# Altium project rs232_24V_step_Vano.PrjPcb
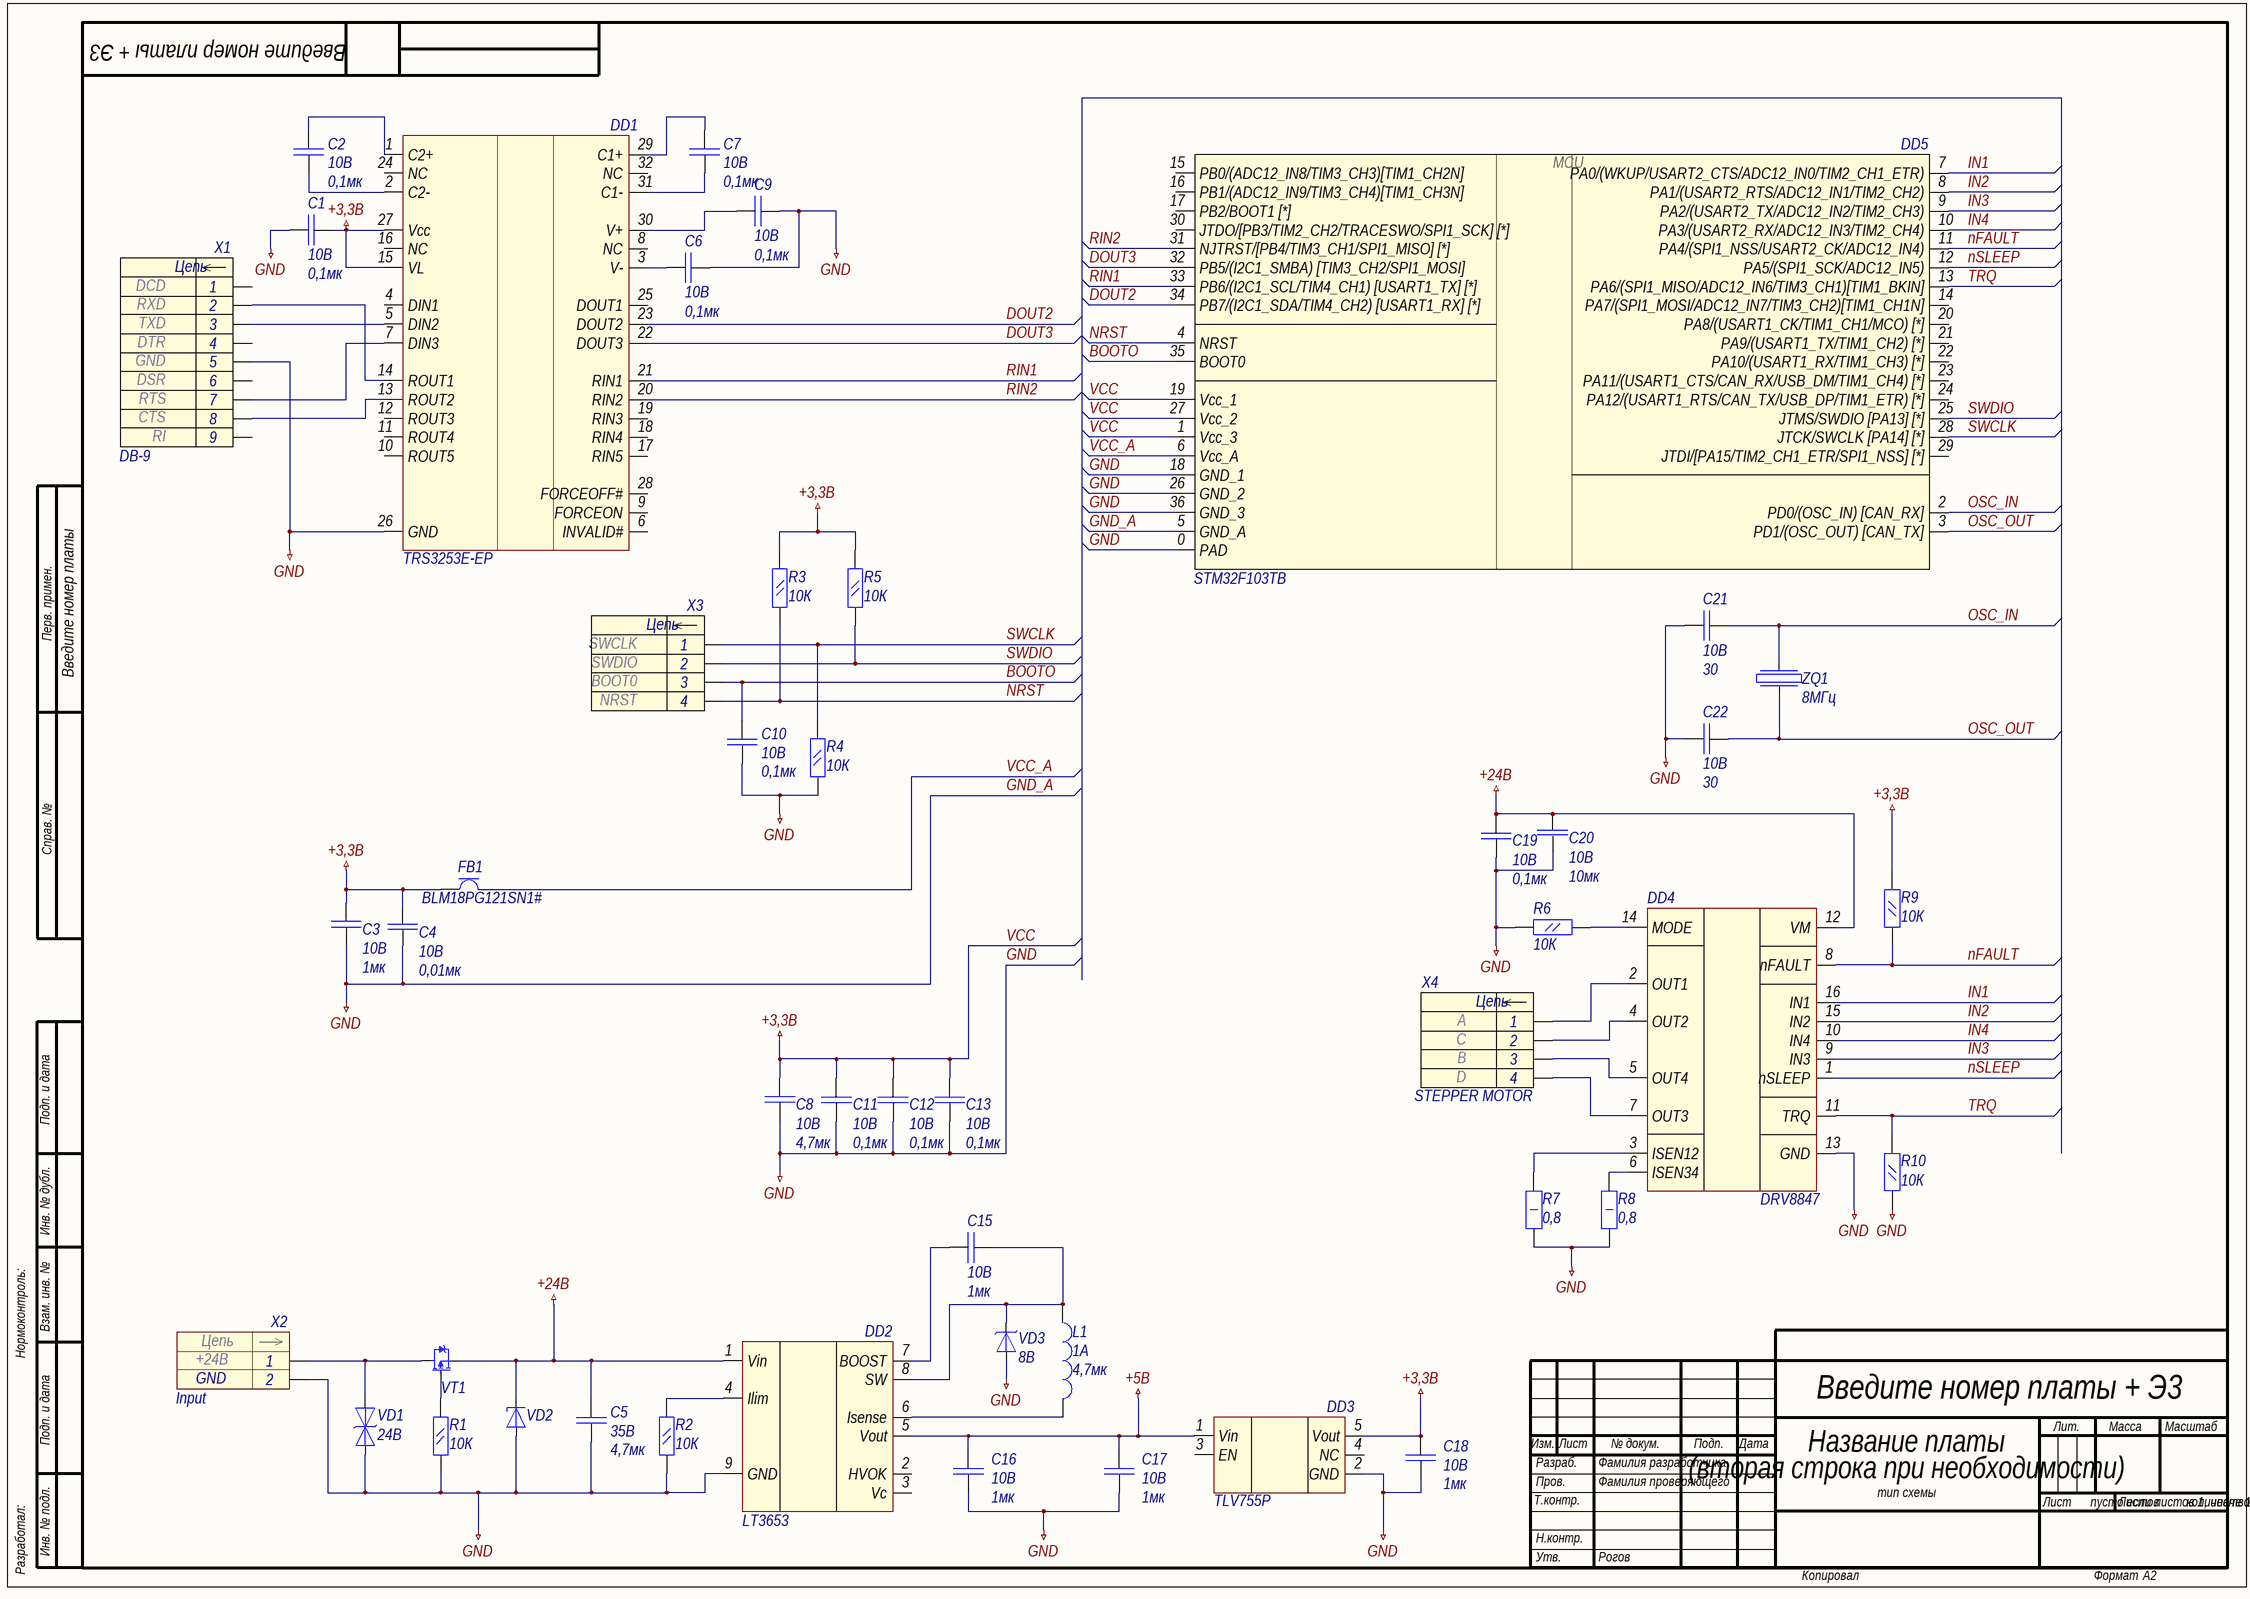
[diagram p0: VanoDolbano.schdoc]
1 sheet, 47 parts. Net scope: global (net labels, ports and power ports of the same name join across sheets).
Board file: rodin_24V_step.PcbDoc

## Sheet VanoDolbano.schdoc: Название платы
size 594 x 420 mm; ApprovedBy: Рогов; CheckedBy: Фамилия проверяющего; DrawnBy: Фамилия разработчика; DocumentNumber: Введите номер платы + Э3; SheetNumber: пусто если листов 1, иначе 1; SheetTotal: количество листов; Format: A2; DocumentType: тип схемы; Title1str: (вторая строка при необходимости); ImagePath: Введите номер платы

### Parts
C1  Voltage: 10В  Capacitance: 0,1мк  [CH0402C]  (hidden comment: Capacitor)
C2  Voltage: 10В  Capacitance: 0,1мк  [CH0402C]  (hidden comment: Capacitor)
C3  Voltage: 10В  Capacitance: 1мк  [CH0201C]  (hidden comment: Capacitor)
C4  Voltage: 10В  Capacitance: 0,01мк  [CH0402C]  (hidden comment: Capacitor)
C5  Voltage: 35В  Capacitance: 4,7мк  [CH0603C]  (hidden comment: Capacitor)
C6  Voltage: 10В  Capacitance: 0,1мк  [CH0402C]  (hidden comment: Capacitor)
C7  Voltage: 10В  Capacitance: 0,1мк  [CH0402C]  (hidden comment: Capacitor)
C8  Voltage: 10В  Capacitance: 4,7мк  [CH0402C]  (hidden comment: Capacitor)
C9  Voltage: 10В  Capacitance: 0,1мк  [CH0402C]  (hidden comment: Capacitor)
C10  Voltage: 10В  Capacitance: 0,1мк  [CH0402C]  (hidden comment: Capacitor)
C11  Voltage: 10В  Capacitance: 0,1мк  [CH0402C]  (hidden comment: Capacitor)
C12  Voltage: 10В  Capacitance: 0,1мк  [CH0402C]  (hidden comment: Capacitor)
C13  Voltage: 10В  Capacitance: 0,1мк  [CH0402C]  (hidden comment: Capacitor)
C15  Voltage: 10В  Capacitance: 1мк  [CH0201C]  (hidden comment: Capacitor)
C16  Voltage: 10В  Capacitance: 1мк  [CH0201C]  (hidden comment: Capacitor)
C17  Voltage: 10В  Capacitance: 1мк  [CH0201C]  (hidden comment: Capacitor)
C18  Voltage: 10В  Capacitance: 1мк  [CH0201C]  (hidden comment: Capacitor)
C19  Voltage: 10В  Capacitance: 0,1мк  [CH0402C]  (hidden comment: Capacitor)
C20  Voltage: 10В  Capacitance: 10мк  [CH0402C]  (hidden comment: Capacitor)
C21  Voltage: 10В  Capacitance: 30  [CH0201C]  (hidden comment: Capacitor)
C22  Voltage: 10В  Capacitance: 30  [CH0201C]  (hidden comment: Capacitor)
DD1  TRS3253E-EP  [TRS3253E-EP]
DD2  LT3653  [LT3653]
DD3  TLV755P  [SOT23-5]
DD4  DRV8847  [DRV8847]
DD5  STM32F103TB  [STM32_f103_36Pins]
FB1  Model: BLM18PG121SN1#  [CH0603L]  (hidden comment: Ferrite bead)
L1  Max current: 1А  Inductance: 4,7мк  [CH0805L]  (hidden comment: Inductor)
R1  Impedance: 10К  [CH0402R]  (hidden comment: Res_0.125)
R2  Impedance: 10К  [CH0402R]  (hidden comment: Res_0.125)
R3  Impedance: 10К  [CH0805R]  (hidden comment: Res_0.125)
R4  Impedance: 10К  [CH0805R]  (hidden comment: Res_0.125)
R5  Impedance: 10К  [CH0805R]  (hidden comment: Res_0.125)
R6  Impedance: 10К  [CH0402R]  (hidden comment: Res_0.125)
R7  Impedance: 0,8  [CH2010R]  (hidden comment: Res_1)
R8  Impedance: 0,8  [CH2010R]  (hidden comment: Res_1)
R9  Impedance: 10К  [CH0402R]  (hidden comment: Res_0.125)
R10  Impedance: 10К  [CH0402R]  (hidden comment: Res_0.125)
VD1  Thresh_Voltage: 24В  [SOD323]  (hidden comment: TVS-diod_simmetrical)
VD2  Diod Zener  [SOD123]  (value not drawn)
VD3  Clamping_Voltage: 8В  [SOD123W]  (hidden comment: TVS-diod_directed)
VT1  P-Channel  [SOT23_132]  (value not drawn)
X1  DB-9  1: DCD  2: RXD  3: TXD  4: DTR  5: GND  6: DSR  7: RTS  8: CTS  9: RI  [CON: DB-9F]
X2  Input  Vcc: +24В  [CON: 163-179PH-EX]
X3  2: SWDIO  3: BOOT0  1: SWCLK  4: NRST  [CON: CWF-4R]  (hidden comment: 4_pins)
X4  STEPPER MOTOR  2: C  3: B  1: A  4: D  [CON: CWF-4R]
ZQ1  Freq: 8МГц  [OSC: 5032]  (hidden comment: Oscillator)

### Nets
+5В: C16.1(C1+) C17.1(C1+) DD2.5(Vout) DD3.1(Vin)
+24В: C5.1(C1+) C19.1(C1+) C20.1(С+) DD2.1(Vin) DD4.12(VM) VD2.2(C) VT1.3(S)
GND: C1.1(C1+) C3.1(C1+) C4.2(С-) C5.2(C1-) C6.2(C1-) C8.1(C1+) C9.2(C1-) C10.2(C1-) C11.2(C1-) C12.2(C1-) C13.2(C1-) C16.2(C1-) C17.2(C1-) C18.2(C1-) C19.2(C1-) C20.2(С-) C21.2(C1-) C22.2(C1-) DD1.26(GND) DD2.9(GND) DD3.2(GND) DD4.13(GND) DD5.0(PAD) DD5.5(GND_A) DD5.18(GND_1) DD5.26(GND_2) DD5.36(GND_3) R1.1 R2.1 R4.1(C1-) R6.1(C1-) R7.1 R8.1 R10.2(C1-) VD1.1(A) VD2.1(A) VD3.1(A) X1.5 X2.2  [also labelled GND_A]
VCC: C1.2(C1-) C3.2(C1-) C4.1(С+) C8.2(C1-) C11.1(C1+) C12.1(C1+) C13.1(C1+) C18.1(C1+) DD1.15(VL) DD1.27(Vcc) DD3.5(Vout) DD5.1(Vcc_3) DD5.19(Vcc_1) DD5.27(Vcc_2) FB1.1 R3.1(C1-) R5.2(C1-) R9.1(C1-)  [also labelled +3,3В]
BOOTO: C10.1(C1+) DD5.35(BOOT0) X3.3
DOUT2: DD1.23(DOUT2) DD5.34(PB7/(I2C1_SDA/TIM4_CH2)_[USART1_RX]_[*])
DOUT3: DD1.22(DOUT3) DD5.32(PB5/(I2C1_SMBA)_[TIM3_CH2/SPI1_MOSI])
IN1: DD4.16(IN1) DD5.7(PA0/(WKUP/USART2_CTS/ADC12_IN0/TIM2_CH1_ETR))
IN2: DD4.15(IN2) DD5.8(PA1/(USART2_RTS/ADC12_IN1/TIM2_CH2))
IN3: DD4.9(IN3) DD5.9(PA2/(USART2_TX/ADC12_IN2/TIM2_CH3))
IN4: DD4.10(IN4) DD5.10(PA3/(USART2_RX/ADC12_IN3/TIM2_CH4))
nFAULT: DD4.8(nFAULT) DD5.11(PA4/(SPI1_NSS/USART2_CK/ADC12_IN4)) R9.2(C1-)
NRST: DD5.4(NRST) R3.2(C1-) X3.4
nSLEEP: DD4.1(nSLEEP) DD5.12(PA5/(SPI1_SCK/ADC12_IN5))
OSC_IN: C21.1(C1+) DD5.2(PD0/(OSC_IN)_[CAN_RX]) ZQ1.1
OSC_OUT: C22.1(C1+) DD5.3(PD1/(OSC_OUT)_[CAN_TX]) ZQ1.3
RIN1: DD1.21(RIN1) DD5.33(PB6/(I2C1_SCL/TIM4_CH1)_[USART1_TX]_[*])
RIN2: DD1.20(RIN2) DD5.31(NJTRST/[PB4/TIM3_CH1/SPI1_MISO]_[*])
SWCLK: DD5.28(JTCK/SWCLK_[PA14]_[*]) R4.2(C1-) X3.1
SWDIO: DD5.25(JTMS/SWDIO_[PA13]_[*]) R5.1(C1-) X3.2
TRQ: DD4.11(TRQ) DD5.13(PA6/(SPI1_MISO/ADC12_IN6/TIM3_CH1)[TIM1_BKIN]) R10.1(C1-)
VCC_A: DD5.6(Vcc_A) FB1.2
NetC2_1: C2.1(C1+) DD1.1(C2+)
NetC2_2: C2.2(C1-) DD1.2(C2-)
NetC6_1: C6.1(C1+) DD1.3(V-)
NetC7_1: C7.1(C1+) DD1.29(C1+)
NetC7_2: C7.2(C1-) DD1.31(C1-)
NetC9_1: C9.1(C1+) DD1.30(V+)
NetC15_1: C15.1(C1+) DD2.7(BOOST)
NetC15_2: C15.2(C1-) DD2.8(SW) L1.1 VD3.2(C)
NetDD1_5: DD1.5(DIN2) X1.3
NetDD1_7: DD1.7(DIN3) X1.7
NetDD1_13: DD1.13(ROUT2) X1.8
NetDD1_14: DD1.14(ROUT1) X1.2
NetDD2_4: DD2.4(Ilim) R2.2
NetDD2_6: DD2.6(Isense) L1.2
NetDD4_2: DD4.2(OUT1) X4.1
NetDD4_3: DD4.3(ISEN12) R7.2
NetDD4_4: DD4.4(OUT2) X4.2
NetDD4_5: DD4.5(OUT4) X4.3
NetDD4_6: DD4.6(ISEN34) R8.2
NetDD4_7: DD4.7(OUT3) X4.4
NetDD4_14: DD4.14(MODE) R6.2(C1-)
NetR1_2: R1.2 VT1.1(G)
NetVD1_2: VD1.2(C) VT1.2(D) X2.1

Not connected (* = marked no-connect by the designer): DD1 4(DIN1) 6(INVALID#) 8(NC) 9(FORCEON) 10(ROUT5) 11(ROUT4) 12(ROUT3) 16(NC) 17(RIN5) 18(RIN4) 19(RIN3) 24(NC) 25(DOUT1) 28(FORCEOFF#) 32(NC); DD2 2(HVOK) 3(Vc); DD3 3(EN) 4(NC); DD5 14(PA7/(SPI1_MOSI/ADC12_IN7/TIM3_CH2)[TIM1_CH1N]) 15(PB0/(ADC12_IN8/TIM3_CH3)[TIM1_CH2N]) 16(PB1/(ADC12_IN9/TIM3_CH4)[TIM1_CH3N]) 17(PB2/BOOT1_[*]) 20(PA8/(USART1_CK/TIM1_CH1/MCO)_[*]) 21(PA9/(USART1_TX/TIM1_CH2)_[*]) 22(PA10/(USART1_RX/TIM1_CH3)_[*]) 23(PA11/(USART1_CTS/CAN_RX/USB_DM/TIM1_CH4)_[*]) 24(PA12/(USART1_RTS/CAN_TX/USB_DP/TIM1_ETR)_[*]) 29(JTDI/[PA15/TIM2_CH1_ETR/SPI1_NSS]_[*]) 30(JTDO/[PB3/TIM2_CH2/TRACESWO/SPI1_SCK]_[*]); X1 1 4 6 9

### Notes on the sheet
- Перв. примен.
- Справ. №
- Подп. и дата
- Инв. № дубл.
- Нормоконтроль:
- Взам. инв. №
- Изм.
- Лист
- № докум.
- Подп.
- Дата
- Лит.
- Масса
- Масштаб
- Т.контр.
- Пров.
- Разраб.
- Листов
- Разработал:
- Инв. № подл.
- Н.контр.
- Утв.
- Копировал
- Формат
- (in symbol 2_pins) Цепь; GND
- (in symbol 4_pins) Цепь
- (in symbol 9_pins) Цепь
- (in symbol STM32F103TB) MCU

### Library data of the parts
C1 C2 C6 C7 C9-C13 C19 = Capacitor: Manufacture: AVX; Model: 0402ZD103KAT2A; Case: 0402; HelpURL: https://ru.mouser.com/ProductDetail/AVX/0402ZD103KAT2A?qs=sGAEpiMZZMs0AnBnWHyRQKdiqyDPVQdAu74W%2fwwRq8A%3d
C3 C15-C18 = Capacitor: Manufacture: Murata Electronics; Model: GRM033C81A105ME05E; Case: 0201; HelpURL: https://ru.mouser.com/ProductDetail/Murata-Electronics/GRM033C81A105ME05E?qs=sGAEpiMZZMs0AnBnWHyRQN7%2fAA2D2lPPXfhIkJ3ChWM%252bNp28BKy3Ug%3d%3d
C4 = Capacitor: Manufacture: Yageo; Model: CC0402MRX7R6BB103; Case: 0402; HelpURL: https://ru.mouser.com/ProductDetail/Yageo/CC0402MRX7R6BB103?qs=sGAEpiMZZMs0AnBnWHyRQCF1lTWZ1EBLC11KxQK9NtY%3D
C5 = Capacitor: Manufacture: TDK; Model: C1608JB1V475M080AC; Case: 0603; HelpURL: https://ru.mouser.com/ProductDetail/TDK/C1608JB1V475M080AC?qs=sGAEpiMZZMs0AnBnWHyRQFv7x1xn%252bYFd6VAPnwlpyGEmZrVGUJGxTQ%3d%3d
C8 = Capacitor: Manufacture: Murata Electronics; Model: ZRB15XR61A475KE01D; Case: 0402; HelpURL: https://ru.mouser.com/ProductDetail/Murata-Electronics/ZRB15XR61A475KE01D?qs=sGAEpiMZZMs0AnBnWHyRQO9VYadaKTO%252beZnE9zFUsbv4FmCibz4ZfQ%3d%3d
C20 = Capacitor: Manufacture: Yageo; Model: CC0402MRX5R6BB106; Case: 0402; HelpURL: https://ru.mouser.com/ProductDetail/Yageo/CC0402MRX5R6BB106?qs=sGAEpiMZZMsh%252B1woXyUXj67dvM3QAimZTx2LImfM178%3D
C21 C22 = Capacitor: Manufacture: KEMET; Model: CBR02C308B8GAC; Case: 0201; HelpURL: https://ru.mouser.com/ProductDetail/KEMET/CBR02C308B8GAC?qs=sGAEpiMZZMs0AnBnWHyRQKJCfzG%2fi9wHnix1yOwfSPhOUzhoHh%252bTpQ%3d%3d
DD1 = TRS3253E-EP: UART - RS232; Manufacture: Texas Instruments; Model: TRS3253E-EP; Case: PQFN-32; HelpURL: http://www.ti.com/product/trs3253e-ep
DD2 = LT3653: 7.5~30 to 5; Case: *; Manufacture: *; Model: LT3653; HelpURL: *
DD3 = LDO +3.3V: Manufacture: Texas Instruments; Case: SOT-23; HelpUrL: http://www.ti.com/product/TLV755P?keyMatch=TLV755P&tisearch=Search-EN-Everything; Model: TLV755P
DD4 = DRV8847: Manufacture: Texas Instruments; HelpURL: http://www.ti.com/product/DRV8847; Case: TSSOP; Model: DRV8847
DD5 = STM32F103TB: Микроконтроллер; Name: STM32F103TB
FB1 = Ferrite bead: Manufacture: murata; Max current: 2A; Impedance: 120; Case: 0603; HelpURL: https://www.murata.com/en-us/products/productdetail?partno=BLM18PG121SN1%23; Inductance: *
L1 = Inductor: Manufacture: Panasonic; Model: ELG-TEA4R7NA; Impedance: 300м; HelpURL: https://ru.mouser.com/ProductDetail/Panasonic/ELG-TEA4R7NA?qs=sGAEpiMZZMsg%252by3WlYCkU%252bdHxGw%252bjF29VUqcX1cNOgM%3d; Case: 0805
R1 R2 R6 R9 R10 = Res_0.125: Manufacture: Yageo; Model: AC0402FR-7W10KL; Case: 0402; HelpURL: https://ru.mouser.com/ProductDetail/Yageo/AC0402FR-7W10KL?qs=sGAEpiMZZMvdGkrng054txbN%2f5LBcxld3gyqgmBuiXRPLjwmdNqO3A%3d%3d
R3-R5 = Res_0.125: Manufacture: Panasonic Industrial Devices; Model: ERJ-6ENF9091V; Case: 0805; HelpURL: https://ru.mouser.com/ProductDetail/Panasonic-Industrial-Devices/ERJ-6ENF9091V?qs=sGAEpiMZZMvdGkrng054tx7%2f6%252bNA3LAJZkxjwUnWjWM%3d
R7 R8 = Res_1: Manufacture: Vishay Dale; Model: CRCW20101K69FKEF; Power: 1Вт; Case: 2010; HelpURL: https://www.digikey.com/product-detail/en/CRCW20101K69FKEF/541-1.69KACCT-ND/1179159?WT.z_cid=ref_netcomponents_dkc_buynow&utm_source=netcomponents&utm_medium=aggregator&utm_campaign=buynow
VD1 = TVS-diod_simmetrical: Manufacturer: Torex Semiconductor; Model: XBP1012-G; Case: SOD-323P; HelpURL: https://ru.mouser.com/Semiconductors/Discrete-Semiconductors/Diodes-Rectifiers/TVS-Diodes-ESD-Suppressors/_/N-azknd?P=1z0z7ymZ1yzv44xZ1y95zfoZ1z0x69g&Ns=Package+%2f+Case%7c0
VD3 = TVS-diod_directed: Manufacturer: Nexperia; Model: PTVS3V3S1UTR,115; HelpURL: https://ru.mouser.com/ProductDetail/Nexperia/PTVS3V3S1UTR115?qs=sGAEpiMZZMsItbzKdwyIe55sLWjhUV0FnMtsDZGUovc%3d; Ipp: *; Case: SOD-123W
VT1 = P-Channel: Manufacture: Diodes Incorporated; Id: 3,4А; Model: DMP4065S-7; Vgs: 1В; Vsd: 40В; HelpURL: https://ru.mouser.com/ProductDetail/Diodes-Incorporated/DMP4065S-7?qs=sGAEpiMZZMshyDBzk1%2fWizUdW5KNcF83uXTduzoNpXIy82%252bBOlvohQ%3d%3d
X1 = 9_pins: Case: DB-9; HelpURL: https://www.digikey.com/product-detail/en/assmann-wsw-components/A-DS-09-LL-Z/AE10972-ND/1241781; Manufacture: *; Model: DB-9
X2 = 2_pins: HelpURL: https://ru.farnell.com/gct-global-connector-technology/dcj250-10-a-k1-k/dc-power-jack-5a-20vdc-black/dp/2524130?st=power%20jack
X3 = 4_pins: Manufacture: Omron Electronics; Model: XN2D-4471; HelpURL: https://ru.mouser.com/ProductDetail/Omron-Electronics/XN2D-4471?qs=sGAEpiMZZMvd2mIcYG7oaC0TeQEBnk0JvHtcE4UuDS0%3D; Case: *
X4 = 4_pins: Bipolar Stepper Motor 200 Step 0.35A 12VDC; Manufacture: stepperonline; ManufactureConnector: Omron Electronics; Model: 8HS11-0204S; ModelConnector: XN2D-4471; HelpURL: https://www.omc-stepperonline.com/nema-8-stepper-motor/nema-8-bipolar-18deg-16ncm-23ozin-02a-48v-20x20x28mm-4-wires-8hs11-0204s.html; Case: 20x20x28mm; CaseConnector: *; HelpURLConnector: https://ru.mouser.com/ProductDetail/Omron-Electronics/XN2D-4471?qs=sGAEpiMZZMvd2mIcYG7oaC0TeQEBnk0JvHtcE4UuDS0%3D
ZQ1 = Oscillator: Manufacture: CTS Electronic Components; Model: 636L3C008M00000; HelpURL: https://ru.mouser.com/ProductDetail/CTS-Electronic-Components/636L3C008M00000?qs=sGAEpiMZZMt8zWNA7msRCjl4WCD9T6KEFNudNQm%252BeAU%3D; Case: 5x3,2mm
VD2 = Diod Zener: ComponentKind: *; Manufacturer: *; Model: *; HelpURL: *; Thresh_Voltage: *